# Altium project Power.PrjPcb
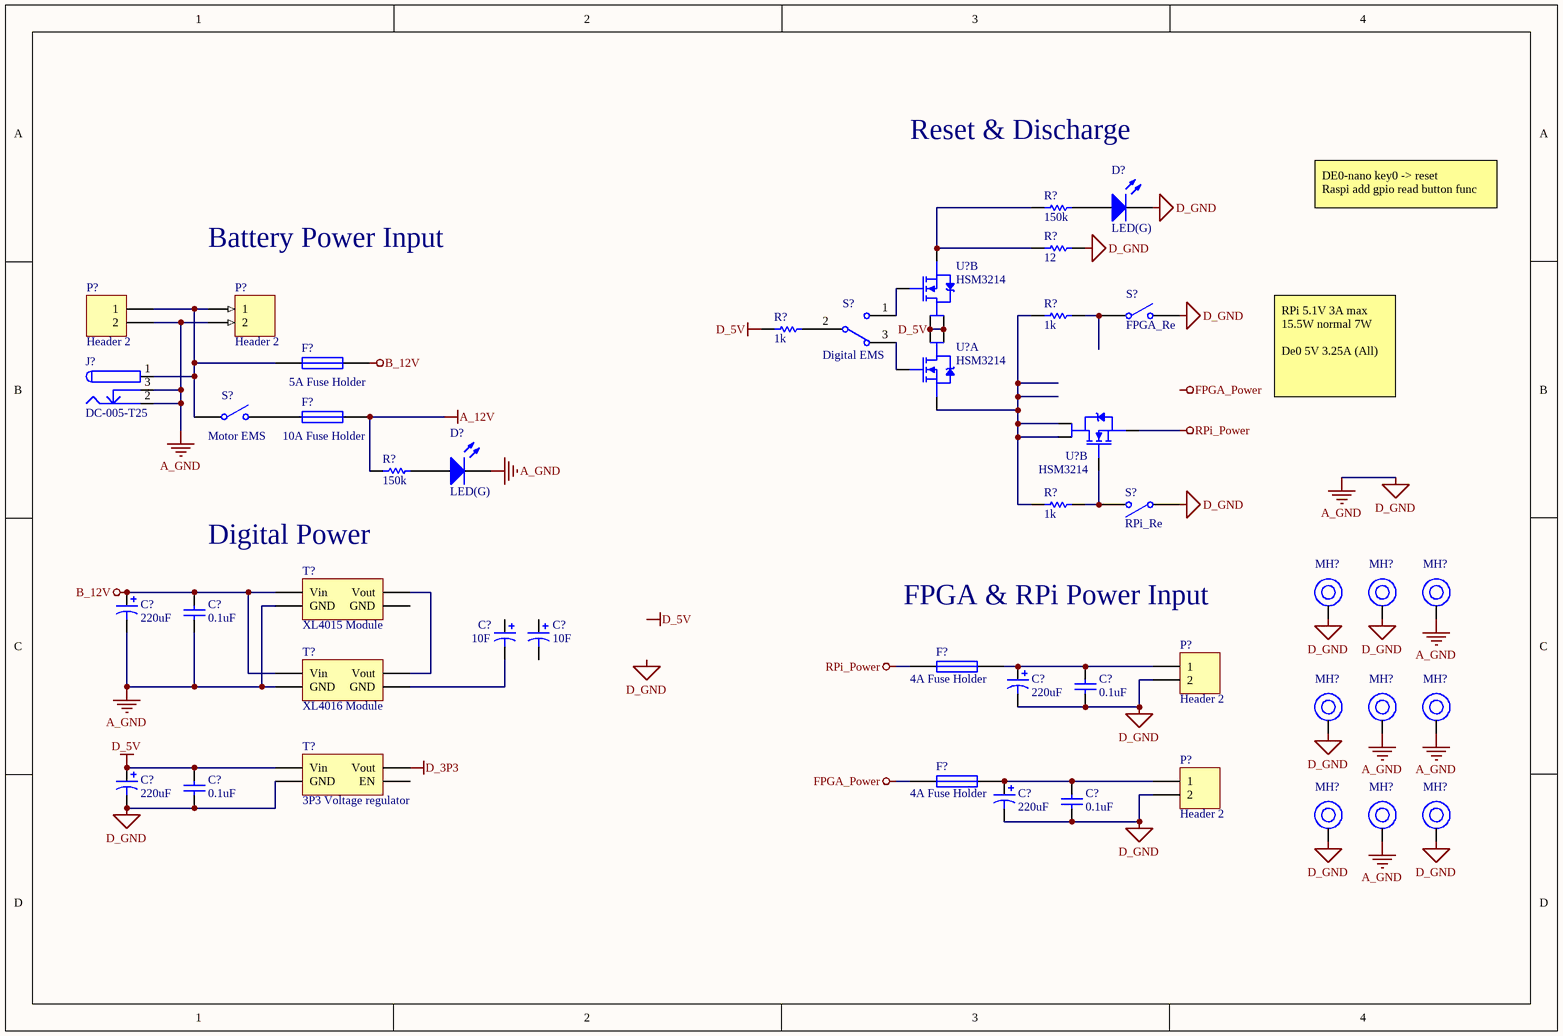
[diagram p0: Power.SchDoc]
2 sheets, 104 parts. Net scope: global (net labels, ports and power ports of the same name join across sheets).
Board file: Power.PcbDoc
Sheets:
  Power.SchDoc
  USB-C Power.SchDoc

## Sheet Power.SchDoc
size A4; SheetNumber: 1; SheetTotal: 2; SPICEModelCacheCCCFIGUR: <root> / <DocumentId>CCCFIGUR</DocumentId> / <CacheFrame Number="0"> / <Model Name="led0" Kind="MDL"> / <Text>*Typ INFRARED GaAs LED: Vf=1.2V Vr=5V If=40mA trr=3uS / *LED Pinout: 1=A, 2=K / .MODEL LED0 D (IS=93.5P RS=84M N=2.63 BV=5 IBV=10U / + CJO=2.97P VJ=.75 M=.333 TT=4.32U)</Text> / </Model> / </CacheFrame> / </root>

### Parts
(Parts that share a designator on the sheet are numbered #1, #2 ... from top to bottom, then left to right.)
C?#1  220uF  [VZT221M1ETR-0607]
C?#2  0.1uF  [1210B104K500NT]
C?#3  10F  [SUPPYCAP-DIP_L33.0_W16.5]
C?#4  10F  [SUPPYCAP-DIP_L33.0_W16.5]
C?#5  220uF  [VZT221M1ETR-0607]
C?#6  0.1uF  [1210B104K500NT]
C?#7  220uF  [VZT221M1ETR-0607]
C?#8  0.1uF  [1210B104K500NT]
C?#9  220uF  [VZT221M1ETR-0607]
C?#10  0.1uF  [1210B104K500NT]
D?#1  LED(G)  [BL-HG036D-AV-TRB]
D?#2  LED(G)  [BL-HG036D-AV-TRB]
F?#1  5A Fuse Holder  [SMD Fuses Holder]
F?#2  10A Fuse Holder  [SMD Fuses Holder]
F?#3  4A Fuse Holder  [SMD Fuses Holder]
F?#4  4A Fuse Holder  [SMD Fuses Holder]
J?  DC-005-T25  [DC-005-T25]
MH?#1  M3 Hole  [M3 Hole]  (value not drawn)
MH?#2  M3 Hole  [M3 Hole]  (value not drawn)
MH?#3  M3 Hole  [M3 Hole]  (value not drawn)
MH?#4  M3 Hole  [M3 Hole]  (value not drawn)
MH?#5  M3 Hole  [M3 Hole]  (value not drawn)
MH?#6  M3 Hole  [M3 Hole]  (value not drawn)
MH?#7  M3 Hole  [M3 Hole]  (value not drawn)
MH?#8  M3 Hole  [M3 Hole]  (value not drawn)
MH?#9  M3 Hole  [M3 Hole]  (value not drawn)
P?#1  Header 2  [XT60PW-M]
P?#2  Header 2  [B2B-XH-A(LF)(SN)]
P?#3  Header 2  [B2B-XH-A(LF)(SN)]
P?#4  Header 2  [B2B-XH-A(LF)(SN)]
R?#1  150k  [RS-03K1503FT]
R?#2  12  [MOF3WS-12Ω±5%T]
R?#3  1k  [RS-03K1503FT]
R?#4  1k  [RS-03K1503FT]
R?#5  150k  [RS-03K1503FT]
R?#6  1k  [RS-03K1503FT]
S?#1  FPGA_Re  [SKHMQLE010]
S?#2  Digital EMS  [ST-0-102-C03-N003-RS]
S?#3  Motor EMS  [JNQ032]
S?#4  RPi_Re  [SKHMQKE010]
T?#1  XL4015 Module  [XL4015 Voltage Regulator Module]
T?#2  XL4016 Module  [XH-M401 Voltage Regulator Module]
T?#3  3P3 Voltage regulator  [Small Voltage regulator module]
U?#1  HSM3214  [HSM3214]  (part B of 2)
U?#2  HSM3214  [HSM3214]  (part A of 2)
U?#3  HSM3214  [HSM3214]  (part B of 2)

### Nets
A_12V: F?#2.2 R?#5.2
A_GND: C?#1.2 C?#2.1 C?#5.2 C?#6.1 C?#7.2 C?#8.1 C?#9.2 C?#10.1 D?#1.2(K) D?#2.2(K) J?.2 J?.3 MH?#1.1 MH?#2.1 MH?#3.1 MH?#4.1 MH?#5.1 MH?#6.1 MH?#7.1 MH?#8.1 MH?#9.1 P?#1.2 P?#2.2 P?#3.2 P?#4.2 R?#2.1 S?#1.2(NO) S?#4.1(COMMON) T?#1.2(GND) T?#2.2(GND) T?#3.2(GND)  [also labelled D_GND]
B_12V: C?#1.1 C?#2.2 F?#1.2 T?#1.1(Vin) T?#2.1(Vin)
D_3P3: T?#3.3(Vout)
D_5V: C?#7.1 C?#8.2 R?#4.2 T?#3.1(Vin) U?#1.5(D1) U?#1.6(D1) U?#2.7(D1) U?#2.8(D1)
FPGA_Power: F?#4.1
RPi_Power: F?#3.1 U?#3.3(S1)
NetC?#3_2: C?#3.2 T?#2.4(GND)
NetC?#5_1: C?#5.1 C?#6.2 F?#3.2 P?#3.1
NetC?#9_1: C?#9.1 C?#10.2 F?#4.2 P?#4.1
NetD?#1_1: D?#1.1(A) R?#1.1
NetD?#2_1: D?#2.1(A) R?#5.1
NetF?#1_1: F?#1.1 J?.1 P?#1.1 P?#2.1 S?#3.1(COMMON)
NetF?#2_1: F?#2.1 S?#3.2(NO)
NetR?#1_2: R?#1.2 R?#2.2 U?#1.3(S1)
NetR?#3_1: R?#3.1 S?#1.1(COMMON)
NetR?#3_2: R?#3.2 R?#6.2 U?#2.1(S1) U?#3.5(D1) U?#3.6(D1)
NetR?#4_1: R?#4.1 S?#2.2
NetR?#6_1: R?#6.1 S?#4.2(NO) U?#3.4(G1)
NetS?#2_1: S?#2.1 U?#1.4(G1)
NetS?#2_3: S?#2.3 U?#2.2(G1)
NetT?#1_3: T?#1.3(Vout) T?#2.3(Vout)

Not connected (* = marked no-connect by the designer): C?#3 1; C?#4 1 2; T?#1 4(GND); T?#3 4(EN)

### Notes on the sheet
- Reset & Discharge
- Battery Power Input
- DE0-nano key0 -> reset
  Raspi add gpio read button func
- RPi 5.1V 3A max 15.5W normal 7W
  De0 5V 3.25A (All)
- Digital Power
- FPGA & RPi Power Input
- Labels drawn without touching a wire or pin: D_5V, D_GND, FPGA_Power

### Library data of the parts
C?#1 C?#5 C?#7 C?#9 = Cap Pol1: -45℃~+105℃ 2000hrs@105℃ 220uF 7.7mm 25V 6.3mm ±20% SMD,6.3x7.7mm  Aluminum Electrolytic Capacitors - SMD ROHS; Published: 8-Jun-2000; LatestRevisionDate: 17-Jul-2002; LatestRevisionNote: Re-released for DXP Platform.; PackageReference: RB7.6-15; Publisher: Altium Limited; PackageDescription: Polarized Capacitor (Radial); 2 Leads
C?#2 C?#6 C?#8 C?#10 = Cap Semi: 50V 100nF X7R ±10% 1210  Multilayer Ceramic Capacitors MLCC - SMD/SMT ROHS; Published: 8-Jun-2000; LatestRevisionDate: 29-May-2009; LatestRevisionNote: IPC-7351 Footprint Added.; PackageReference: C1206; Publisher: Altium Limited; PackageDescription: Chip Capacitor
C?#3 C?#4 = Cap Pol1: CAPACITOR 10F -10% +30% 5.5V T/H; Published: 8-Jun-2000; LatestRevisionDate: 17-Jul-2002; LatestRevisionNote: Re-released for DXP Platform.; PackageReference: RB7.6-15; Publisher: Altium Limited; PackageDescription: Polarized Capacitor (Radial); 2 Leads
D?#1 D?#2 = LED0: Green-yellow 0603 Light Emitting Diodes (LED) RoHS; Published: 8-Jun-2000; LatestRevisionDate: 08-Jul-2005; LatestRevisionNote: Mech Layer 1 removed.; PackageReference: LED-0; Publisher: Altium Limited; PackageDescription: LED; 2 Leads
F?#1 = Fuse 1: 01550900M (Fuse Holder) / SMD,9.73x5.03mm Fuse Holders ROHS / ----- / 0451005.MRL (Fuse) / FastBlow 50A SMD Fuse 5A 5.566 12.5mΩ SMD  Fuses ROHS; Published: 8-Jun-2000; LatestRevisionDate: 17-Jul-2002; LatestRevisionNote: Re-released for DXP Platform.; PackageReference: PIN-W2/E2.8; Publisher: Altium Limited; PackageDescription: Thru-Hole; 2 Leads
F?#2 = Fuse 1: 01550900M (Fuse Holder) / SMD,9.73x5.03mm Fuse Holders ROHS / ----- / 0451010.MRL (Fuse) / FastBlow 50A SMD Fuse 10A 26.46 5.6mΩ SMD  Fuses ROHS; Published: 8-Jun-2000; LatestRevisionDate: 17-Jul-2002; LatestRevisionNote: Re-released for DXP Platform.; PackageReference: PIN-W2/E2.8; Publisher: Altium Limited; PackageDescription: Thru-Hole; 2 Leads
F?#3 F?#4 = Fuse 1: 01550900M (Fuse Holder) / SMD,9.73x5.03mm Fuse Holders ROHS / ----- / 0451004.MRL (Fuse) / FastBlow 50A SMD Fuse 4A 3.152 16mΩ SMD  Fuses ROHS; Published: 8-Jun-2000; LatestRevisionDate: 17-Jul-2002; LatestRevisionNote: Re-released for DXP Platform.; PackageReference: PIN-W2/E2.8; Publisher: Altium Limited; PackageDescription: Thru-Hole; 2 Leads
J? = PWR2.5: Shrouded DC Power Receptacle -10℃~+60℃ 2.5mm 6.3mm 3A 30V Plugin AC/DC Power Connectors ROHS; Published: 17-Dec-2003; DatasheetDocument: 09-May-2002; Publisher: Altium Limited; ComponentLink1Description: Manufacturer Link; ComponentLink1URL: http://domino.kycon.com/internet/Products.html
MH?#1-MH?#9 = M3_Hole
P?#1 = Header 2: XT60PW-F 500V 45A Through Hole Power Connectors ROHS; LatestRevisionDate: 17-Jul-2002; LatestRevisionNote: Re-released for DXP Platform.; Publisher: Altium Limited
P?#2-P?#4 = Header 2: 1x2P XH 1 2.5mm 2 Brass Plugin,P=2.5mm  Wire To Board / Wire To Wire Connector ROHS; LatestRevisionDate: 17-Jul-2002; LatestRevisionNote: Re-released for DXP Platform.; Publisher: Altium Limited
R?#1 R?#3-R?#6 = Res1: 100mW 50V ±1% ±100ppm/℃ -55℃~+155℃ 150kΩ 0603  Chip Resistor - Surface Mount ROHS; Published: 8-Jun-2000; LatestRevisionDate: 17-Jul-2002; LatestRevisionNote: Re-released for DXP Platform.; PackageReference: AXIAL-0.3; Publisher: Altium Limited; PackageDescription: Axial Device, Thru-Hole; 2 Leads; 0.3 in Pin Spacing
R?#2 = Res1: Metal Oxide Resistors 12Ω 3W ±700ppm/℃ ±5% Axial Leaded  Through Hole Resistors ROHS; Published: 8-Jun-2000; LatestRevisionDate: 17-Jul-2002; LatestRevisionNote: Re-released for DXP Platform.; PackageReference: AXIAL-0.3; Publisher: Altium Limited; PackageDescription: Axial Device, Thru-Hole; 2 Leads; 0.3 in Pin Spacing
S?#1 S?#4 = SW-SPST: 6.2mm 3.1mm Round Button 50mA Brick nogging 6.5mm SPST 12V SMD  Tactile Switches ROHS; Published: 24-Mar-1999; LatestRevisionDate: 17-Jul-2002; LatestRevisionNote: Re-released for DXP Platform.; PackageReference: SPST-2; Publisher: Altium Limited; PackageDescription: Switch; 2 Leads
S?#2 = SW-SPDT: Cylindrical button handle 125V -25℃~85℃ SPDT PCPin 40000 3A Plugin  Toggle Switches ROHS; Published: 24-Mar-1999; LatestRevisionDate: 17-Dec-2003; LatestRevisionNote: Schematic revised, PCB Footprint replaced.; DatasheetVersion: 05-Dec-2000; PackageReference: TL36WW15050; Publisher: Altium Limited; PackageDescription: Switch; 4 Leads; ComponentLink1Description: Manufacturer Link; ComponentLink1URL: http://www.apem.com
S?#3 = SW-SPST: JNQ032 (Header) / 30A Short Connection Quick connect terminal Plugin  Cold-pressed?Terminals ROHS / ----- / RT-S02-113-R42BR (Switch) / Through Hole Rocker Switches ROHS; Published: 24-Mar-1999; LatestRevisionDate: 17-Jul-2002; LatestRevisionNote: Re-released for DXP Platform.; PackageReference: SPST-2; Publisher: Altium Limited; PackageDescription: Switch; 2 Leads
T?#1 = Non-isolated Voltage regulator: XL4015E1 (Module) / Step-down type TO-263-5  DC-DC Converters ROHS / ----- / A2541HWV-2x2P (Header) / 2.54mm 2.54mm Gold Brass Straight 2x2P 4 2 Plugin,P=2.54mm  Female Headers ROHS
T?#2 = Non-isolated Voltage regulator: NO Step-down type 1 Step-down 1.25V~36V 8V~40V 8A 180kHz TO-220-5  DC-DC Converters ROHS
T?#3 = Non-isolated Voltage regulator: 3A Non-isolated Voltage Regulator; ComponentLink1Description: buy_link; ComponentLink1URL: https://www.ruten.com.tw/item/show?21817939184609
U?#1-U?#3 = HSM3214: 30V 10A 12mΩ@10V,8A 1.5W 2.5V@250μA 2 N-Channel SOP-8  MOSFETs ROHS

## Sheet USB-C Power.SchDoc
size A4; SheetNumber: 2; SheetTotal: 2; SPICEModelCacheBOOBVADC: <root> / <DocumentId>BOOBVADC</DocumentId> / </root>
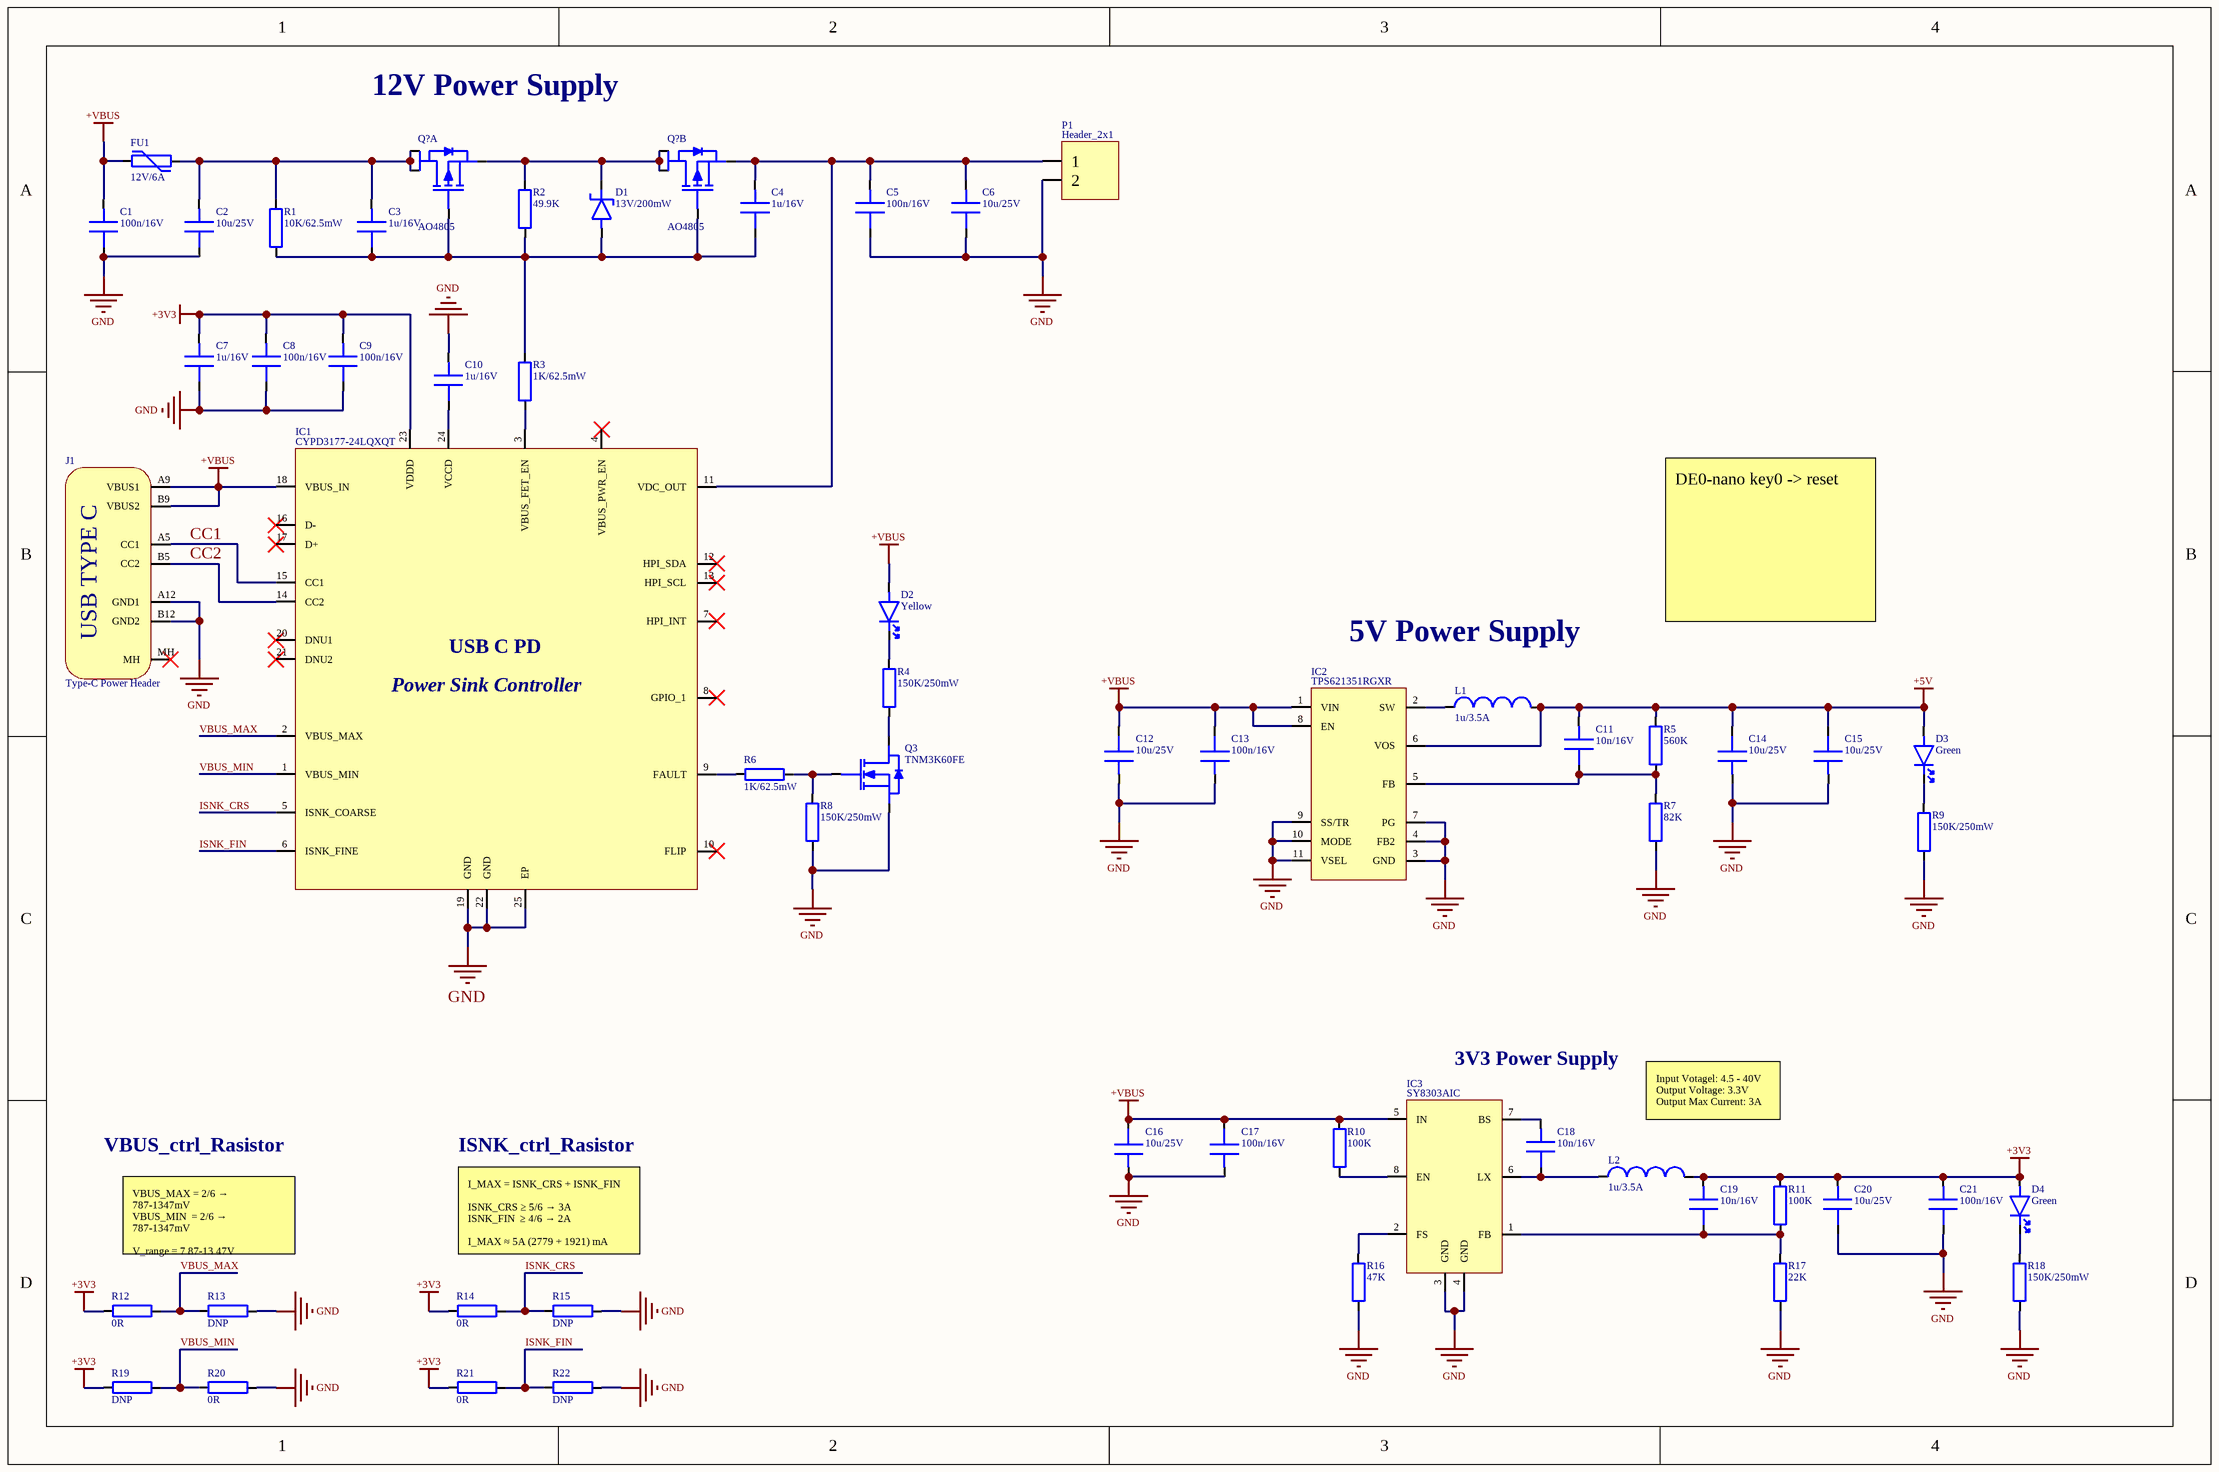
[diagram p1: USB-C Power.SchDoc]

### Parts
(Parts that share a designator on the sheet are numbered #1, #2 ... from top to bottom, then left to right.)
C1  100n/16V  [0805_Cap]
C2  10u/25V  [0805_Cap]
C3  1u/16V  [0805_Cap]
C4  1u/16V  [0805_Cap]
C5  100n/16V  [0805_Cap]
C6  10u/25V  [0805_Cap]
C7  1u/16V  [0805_Cap]
C8  100n/16V  [0805_Cap]
C9  100n/16V  [0805_Cap]
C10  1u/16V  [0805_Cap]
C11  10n/16V  [0805_Cap]
C12  10u/25V  [0805_Cap]
C13  100n/16V  [0805_Cap]
C14  10u/25V  [0805_Cap]
C15  10u/25V  [0805_Cap]
C16  10u/25V  [0805_Cap]
C17  100n/16V  [0805_Cap]
C18  10n/16V  [0805_Cap]
C19  10n/16V  [0805_Cap]
C20  10u/25V  [0805_Cap]
C21  100n/16V  [0805_Cap]
D1  13V/200mW  [SOD-523]
D2  Yellow  [0603_LED]
D3  Green  [0603_LED]
D4  Green  [0603_LED]
FU1  12V/6A  [1206_fuse]
IC1  CYPD3177-24LQXQT  [QFN-24]
IC2  TPS621351RGXR  [TSOT-23-8]
IC3  SY8303AIC
J1  Type-C Power Header  [1016435900011LF]
L1  1u/3.5A
L2  1u/3.5A
P1  Header_2x1
Q3  TNM3K60FE
Q?#1  AO4805  [SOIC-8]  (part A of 2)
Q?#2  AO4805  [SOIC-8]  (part B of 2)
R1  10K/62.5mW  [0603_Res]
R2  49.9K  [0603_Res]
R3  1K/62.5mW  [0603_Res]
R4  150K/250mW  [0603_Res]
R5  560K  [0603_Res]
R6  1K/62.5mW  [0603_Res]
R7  82K  [0603_Res]
R8  150K/250mW  [0603_Res]
R9  150K/250mW  [0603_Res]
R10  100K  [0603_Res]
R11  100K  [0603_Res]
R12  0R  [0603_Res]
R13  DNP  [0603_Res]
R14  0R  [0603_Res]
R15  DNP  [0603_Res]
R16  47K  [0603_Res]
R17  22K  [0603_Res]
R18  150K/250mW  [0603_Res]
R19  DNP  [0603_Res]
R20  0R  [0603_Res]
R21  0R  [0603_Res]
R22  DNP  [0603_Res]

### Nets
+3V3: C7.1 C8.1 C9.1 C19.1 C20.1 C21.1 D4.1(A) IC1.23(VDDD) L2.2 R11.1 R12.1 R14.1 R19.1 R21.1
+5V: C11.1 C14.2 C15.2 D3.1(A) IC2.6(VOS) L1.2 R5.1
+VBUS: C1.1 C12.2 C13.2 C16.2 C17.2 D2.1(A) FU1.1 IC1.18(VBUS_IN) IC2.1(VIN) IC2.8(EN) IC3.5(IN) J1.A9(VBUS1) J1.B9(VBUS2) R10.2
GND: C1.2 C2.2 C5.2 C6.2 C7.2 C8.2 C9.2 C10.1 C12.1 C13.1 C14.1 C15.1 C16.1 C17.1 C20.2 C21.2 IC1.19(GND) IC1.22(GND) IC1.25(EP) IC2.3(GND) IC2.4(FB2) IC2.7(PG) IC2.9(SS/TR) IC2.10(MODE) IC2.11(VSEL) IC3.3(GND) IC3.4(GND) J1.A12(GND1) J1.B12(GND2) P1.2 Q3.3(S) R7.2 R8.2 R9.1 R13.2 R15.2 R16.2 R17.2 R18.1 R20.2 R22.2
CC1: IC1.15(CC1) J1.A5(CC1)
CC2: IC1.14(CC2) J1.B5(CC2)
ISNK_CRS: IC1.5(ISNK_COARSE) R14.2 R15.1
ISNK_FIN: IC1.6(ISNK_FINE) R21.2 R22.1
VBUS_MAX: IC1.2(VBUS_MAX) R12.2 R13.1
VBUS_MIN: IC1.1(VBUS_MIN) R19.2 R20.1
NetC2_1: C2.1 C3.1 FU1.2 Q?#1.5(D1) Q?#1.6(D1) R1.2
NetC3_2: C3.2 C4.2 D1.1(A) Q?#1.4(G1) Q?#2.2(G2) R1.1 R2.1 R3.2
NetC4_1: C4.1 C5.1 C6.1 IC1.11(VDC_OUT) P1.1 Q?#2.1(S2)
NetC10_2: C10.2 IC1.24(VCCD)
NetC11_2: C11.2 IC2.5(FB) R5.2 R7.1
NetC18_1: C18.1 IC3.7(BS)
NetC18_2: C18.2 IC3.6(LX) L2.1
NetC19_2: C19.2 IC3.1(FB) R11.2 R17.1
NetD1_2: D1.2(K) Q?#1.3(S1) Q?#2.7(D2) Q?#2.8(D2) R2.2
NetD2_2: D2.2(K) R4.2
NetD3_2: D3.2(K) R9.2
NetD4_2: D4.2(K) R18.2
NetIC1_3: IC1.3(VBUS_FET_EN) R3.1
NetIC1_9: IC1.9(FAULT) R6.1
NetIC2_2: IC2.2(SW) L1.1
NetIC3_2: IC3.2(FS) R16.1
NetIC3_8: IC3.8(EN) R10.1
NetQ3_1: Q3.1(D) R4.1
NetQ3_2: Q3.2(G) R6.2 R8.1

Not connected (* = marked no-connect by the designer): IC1 4(VBUS_PWR_EN)* 7(HPI_INT)* 8(GPIO_1)* 10(FLIP)* 12(HPI_SDA)* 13(HPI_SCL)* 16(D-)* 17(D+)* 20(DNU1)* 21(DNU2)*; J1 MH*

### Notes on the sheet
- (near Q?#1) 12V Power Supply
- DE0-nano key0 -> reset
- 5V Power Supply
- 3V3 Power Supply
- Input Votagel: 4.5 - 40V
  Output Voltage: 3.3V
  Output Max Current: 3A
- VBUS_ctrl_Rasistor
- ISNK_ctrl_Rasistor
- VBUS_MAX = 2/6 → 787-1347mV
  VBUS_MIN  = 2/6 → 787-1347mV
  V_range = 7.87-13.47V
- I_MAX = ISNK_CRS + ISNK_FIN
  ISNK_CRS ≥ 5/6 → 3A
  ISNK_FIN  ≥ 4/6 → 2A
  I_MAX ≈ 5A (2779 + 1921) mA
- (in symbol CYPD3177-24LQXQ) USB C PD; Power Sink Controller
- (in symbol Type-C_6_Female) USB TYPE C

### Library data of the parts
C1-C21 = Cap: General capacitor (non-polarized); Mfr. #: *; Mfr.: *; Datasheet: *; Distributor_Link: *; Distributor #: *
D1 = Diode_Zener: General zener diode; Mfr. #: *; Mfr.: *; Distributor_Link: *; Datasheet: *; Distributor #: *
D2-D4 = LED: General LED; Mfr. #: *; Mfr.: *; Distributor_Link: *; Datasheet: *; Distributor #: *
FU1 = Fuse: General fuse; Mfr. #: *; Mfr.: *; Distributor_Link: *; Datasheet: *; Distributor #: *
IC1 = CYPD3177-24LQXQ: USB Interface IC USB Type-C port controller CYPD3177; Mfr.: Infineon Technologies; Distributor_Link: https://www.mouser.tw/ProductDetail/727-CYPD3177-24LQXQT; Mfr. #: CYPD3177-24LQXQT; Datasheet: https://www.mouser.tw/datasheet/2/196/Infineon_EZ_PD_BCR_Datasheet_USB_Type_C_Port_Contr-3161917.pdf; Distributor #: 727-CYPD3177-24LQXQT
IC2 = TPS621351RGXR: Switching Voltage Regulators 3-17V 4.0A Step-Down Converter with 1% accuracy and PFM/Forced-PWM in 2x3QFN 11-VQFN-HR -40 to 125; Mfr.: Texas Instruments; Distributor_Link: https://jlcpcb.com/partdetail/TexasInstruments-TPS621351RGXR/C2070706; Mfr. #: TPS621351RGXR; Datasheet: https://www.ti.com/general/docs/suppproductinfo.tsp?distId=26&gotoUrl=https://www.ti.com/lit/gpn/tps62135; Distributor #: C2070706
IC3 = SY8303AIC: Step-down type TSOT-23-8 DC-DC Converters ROHS; Mfr.: Silergy Corp; Distributor_Link: https://www.mouser.tw/ProductDetail/727-CYPD3177-24LQXQT; Mfr. #: SY8303AIC; Datasheet: https://datasheet.lcsc.com/lcsc/1811151653_Silergy-Corp-SY8303AIC_C97054.pdf; Distributor #: C97054
J1 = Type-C_6_Female: Gerenal Type-C female header; MFR. #: *; Mfr.: *; Distributor_Link: *; Datasheet: *; Distributor #: *
L1 L2 = Inductor: General Inductor; Mfr. #: *; Mfr.: *; Distributor_Link: *; Datasheet: *; Distributor #: *
P1 = Header_2x1: General header 2x1; Mfr. #: *; Mfr.: *; Distributor_Link: *; Datasheet: *
Q3 = MOSFET_N: General n channel mosfet; Mfr. #: *; Mfr.: *; Distributor_Link: *; Datasheet: *; Distributor #: *
Q?#1 Q?#2 = MOSFET_P_2ch: General 2 Channel p mosfet; Mfr. #: *; Mfr.: *; Distributor_Link: *; Datasheet: *; Distributor #: *
R1-R22 = Res: General Resistor; Mfr. #: *; Mfr.: *; Distributor_Link: *; Datasheet: *; Distributor #: *